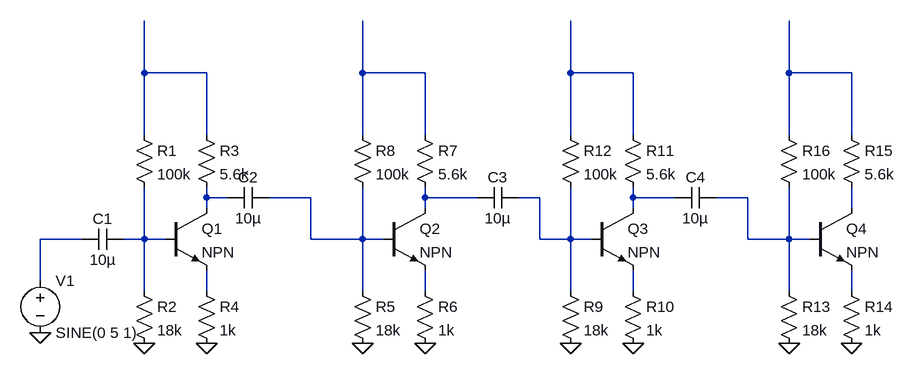
[diagram p0: schematic cascaded high_gain amp.asc]
cascaded high_gain amp.asc, the LTspice schematic file:
Version 4.1
SHEET 1 1280 680
WIRE 96 -96 96 -176
WIRE 192 -96 96 -96
WIRE 432 -96 432 -176
WIRE 528 -96 432 -96
WIRE 752 -96 752 -176
WIRE 848 -96 752 -96
WIRE 1088 -96 1088 -176
WIRE 1184 -96 1088 -96
WIRE 96 0 96 -96
WIRE 192 0 192 -96
WIRE 432 0 432 -96
WIRE 528 0 528 -96
WIRE 752 0 752 -96
WIRE 848 0 848 -96
WIRE 1088 0 1088 -96
WIRE 1184 0 1184 -96
WIRE 192 96 192 80
WIRE 224 96 192 96
WIRE 352 96 288 96
WIRE 528 96 528 80
WIRE 608 96 528 96
WIRE 704 96 672 96
WIRE 848 96 848 80
WIRE 912 96 848 96
WIRE 1024 96 976 96
WIRE 192 112 192 96
WIRE 528 112 528 96
WIRE 848 112 848 96
WIRE 1184 112 1184 80
WIRE 0 160 -64 160
WIRE 96 160 96 80
WIRE 96 160 64 160
WIRE 128 160 96 160
WIRE 352 160 352 96
WIRE 432 160 432 80
WIRE 432 160 352 160
WIRE 464 160 432 160
WIRE 704 160 704 96
WIRE 752 160 752 80
WIRE 752 160 704 160
WIRE 784 160 752 160
WIRE 1024 160 1024 96
WIRE 1088 160 1088 80
WIRE 1088 160 1024 160
WIRE 1120 160 1088 160
WIRE -64 224 -64 160
WIRE 96 240 96 160
WIRE 192 240 192 208
WIRE 432 240 432 160
WIRE 528 240 528 208
WIRE 752 240 752 160
WIRE 848 240 848 208
WIRE 1088 240 1088 160
WIRE 1184 240 1184 208
FLAG 96 320 0
FLAG 192 320 0
FLAG -64 304 0
FLAG 432 320 0
FLAG 528 320 0
FLAG 752 320 0
FLAG 848 320 0
FLAG 1088 320 0
FLAG 1184 320 0
SYMBOL npn 128 112 R0
SYMATTR InstName Q1
SYMBOL res 80 -16 R0
SYMATTR InstName R1
SYMATTR Value 100k
SYMBOL res 80 224 R0
SYMATTR InstName R2
SYMATTR Value 18k
SYMBOL res 176 -16 R0
SYMATTR InstName R3
SYMATTR Value 5.6k
SYMBOL res 176 224 R0
SYMATTR InstName R4
SYMATTR Value 1k
SYMBOL cap 64 144 R90
WINDOW 0 0 32 VBottom 2
WINDOW 3 32 32 VTop 2
SYMATTR InstName C1
SYMATTR Value 10µ
SYMBOL voltage -64 208 R0
WINDOW 123 0 0 Left 0
WINDOW 39 0 0 Left 0
SYMATTR InstName V1
SYMATTR Value SINE(0 5 1)
SYMBOL cap 288 80 R90
WINDOW 0 0 32 VBottom 2
WINDOW 3 32 32 VTop 2
SYMATTR InstName C2
SYMATTR Value 10µ
SYMBOL npn 464 112 R0
SYMATTR InstName Q2
SYMBOL res 416 224 R0
SYMATTR InstName R5
SYMATTR Value 18k
SYMBOL res 512 224 R0
SYMATTR InstName R6
SYMATTR Value 1k
SYMBOL res 512 -16 R0
SYMATTR InstName R7
SYMATTR Value 5.6k
SYMBOL res 416 -16 R0
SYMATTR InstName R8
SYMATTR Value 100k
SYMBOL npn 784 112 R0
SYMATTR InstName Q3
SYMBOL res 736 224 R0
SYMATTR InstName R9
SYMATTR Value 18k
SYMBOL res 832 224 R0
SYMATTR InstName R10
SYMATTR Value 1k
SYMBOL res 832 -16 R0
SYMATTR InstName R11
SYMATTR Value 5.6k
SYMBOL res 736 -16 R0
SYMATTR InstName R12
SYMATTR Value 100k
SYMBOL npn 1120 112 R0
SYMATTR InstName Q4
SYMBOL res 1072 224 R0
SYMATTR InstName R13
SYMATTR Value 18k
SYMBOL res 1168 224 R0
SYMATTR InstName R14
SYMATTR Value 1k
SYMBOL res 1168 -16 R0
SYMATTR InstName R15
SYMATTR Value 5.6k
SYMBOL res 1072 -16 R0
SYMATTR InstName R16
SYMATTR Value 100k
SYMBOL cap 672 80 R90
WINDOW 0 0 32 VBottom 2
WINDOW 3 32 32 VTop 2
SYMATTR InstName C3
SYMATTR Value 10µ
SYMBOL cap 976 80 R90
WINDOW 0 0 32 VBottom 2
WINDOW 3 32 32 VTop 2
SYMATTR InstName C4
SYMATTR Value 10µ

The netlist it stands for:
* cascaded high_gain amp.asc
Q1 N005 N013 N014 0 NPN
R1 N001 N013 100k
R2 N013 0 18k
R3 N001 N005 5.6k
R4 N014 0 1k
C1 N013 N012 10µ
V1 N012 0 SINE(0 5 1)
C2 N006 N005 10µ
Q2 N007 N006 N015 0 NPN
R5 N006 0 18k
R6 N015 0 1k
R7 N002 N007 5.6k
R8 N002 N006 100k
Q3 N009 N008 N016 0 NPN
R9 N008 0 18k
R10 N016 0 1k
R11 N003 N009 5.6k
R12 N003 N008 100k
Q4 N011 N010 N017 0 NPN
R13 N010 0 18k
R14 N017 0 1k
R15 N004 N011 5.6k
R16 N004 N010 100k
C3 N008 N007 10µ
C4 N010 N009 10µ
.model NPN NPN
.model PNP PNP
.lib standard.bjt
.backanno
.end